# EAGLE board Wallaby2[1] (EAGLE 7.7.0), part 1 of 2
REV: B
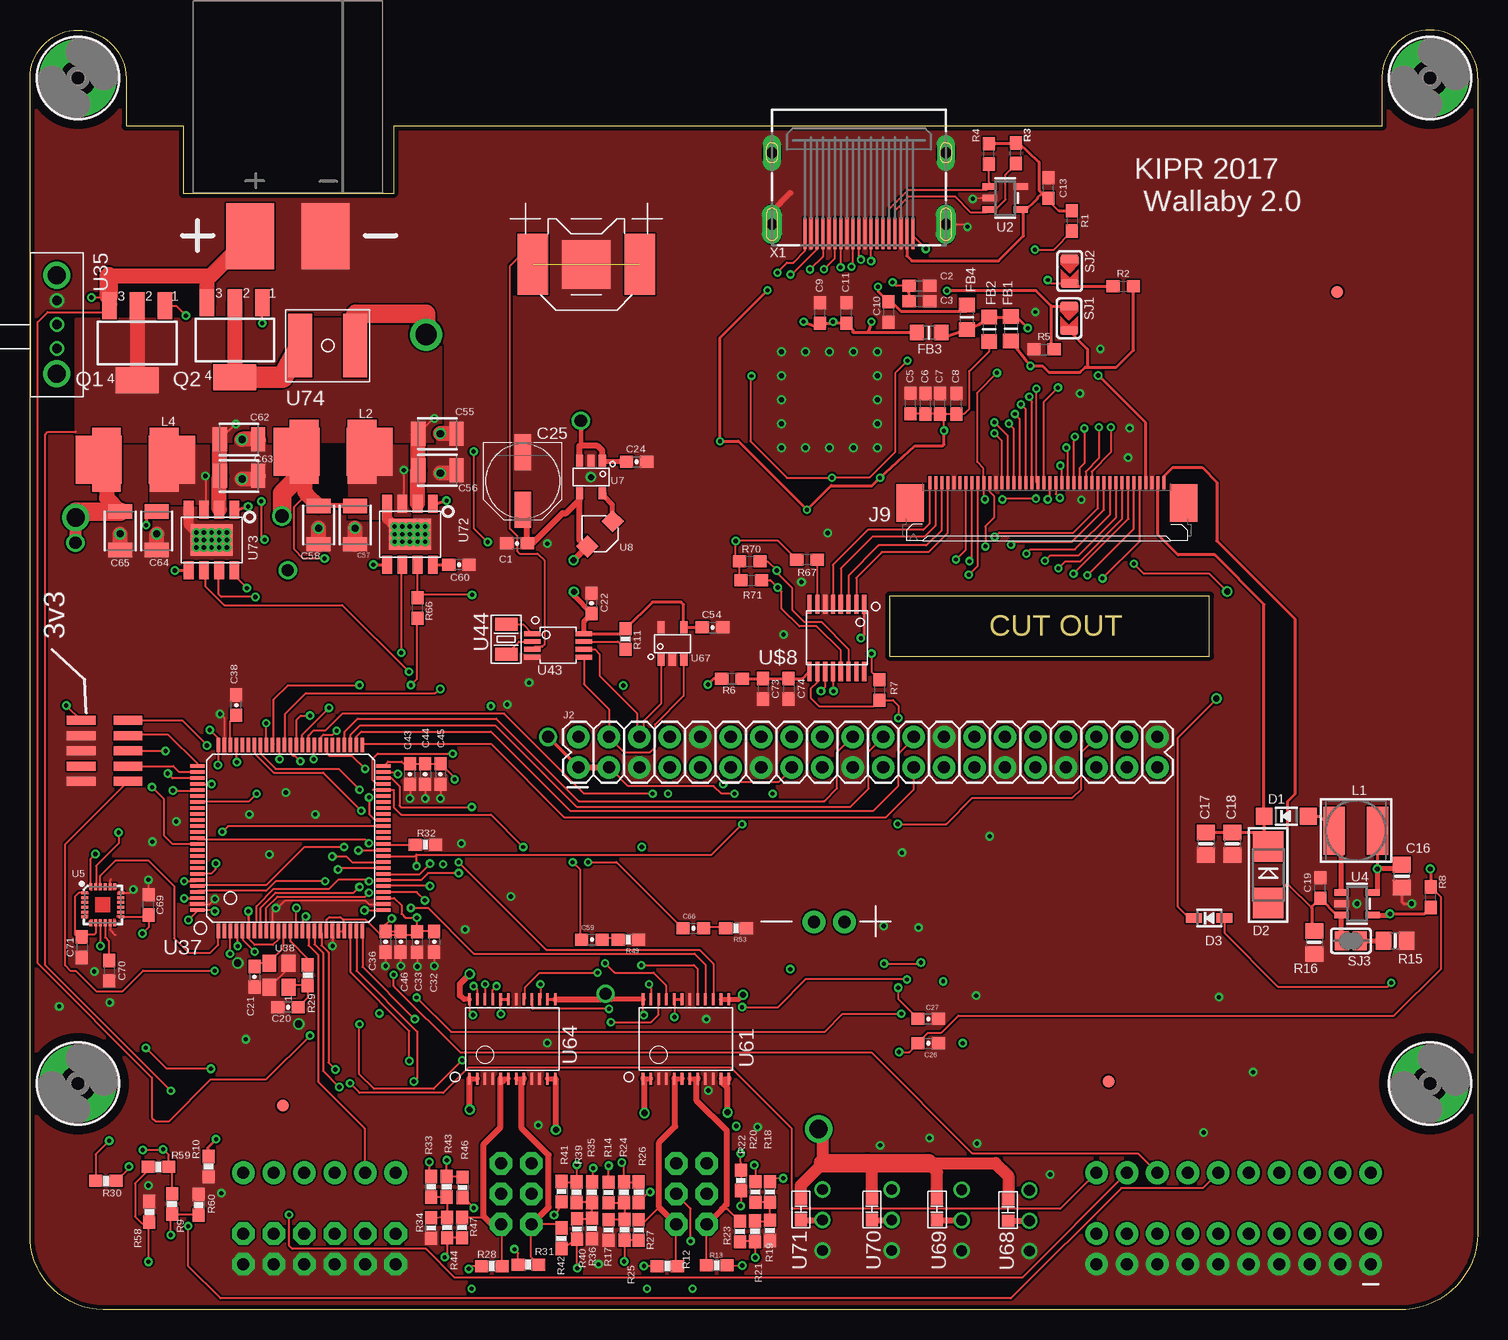
[diagram p17: board, top side]
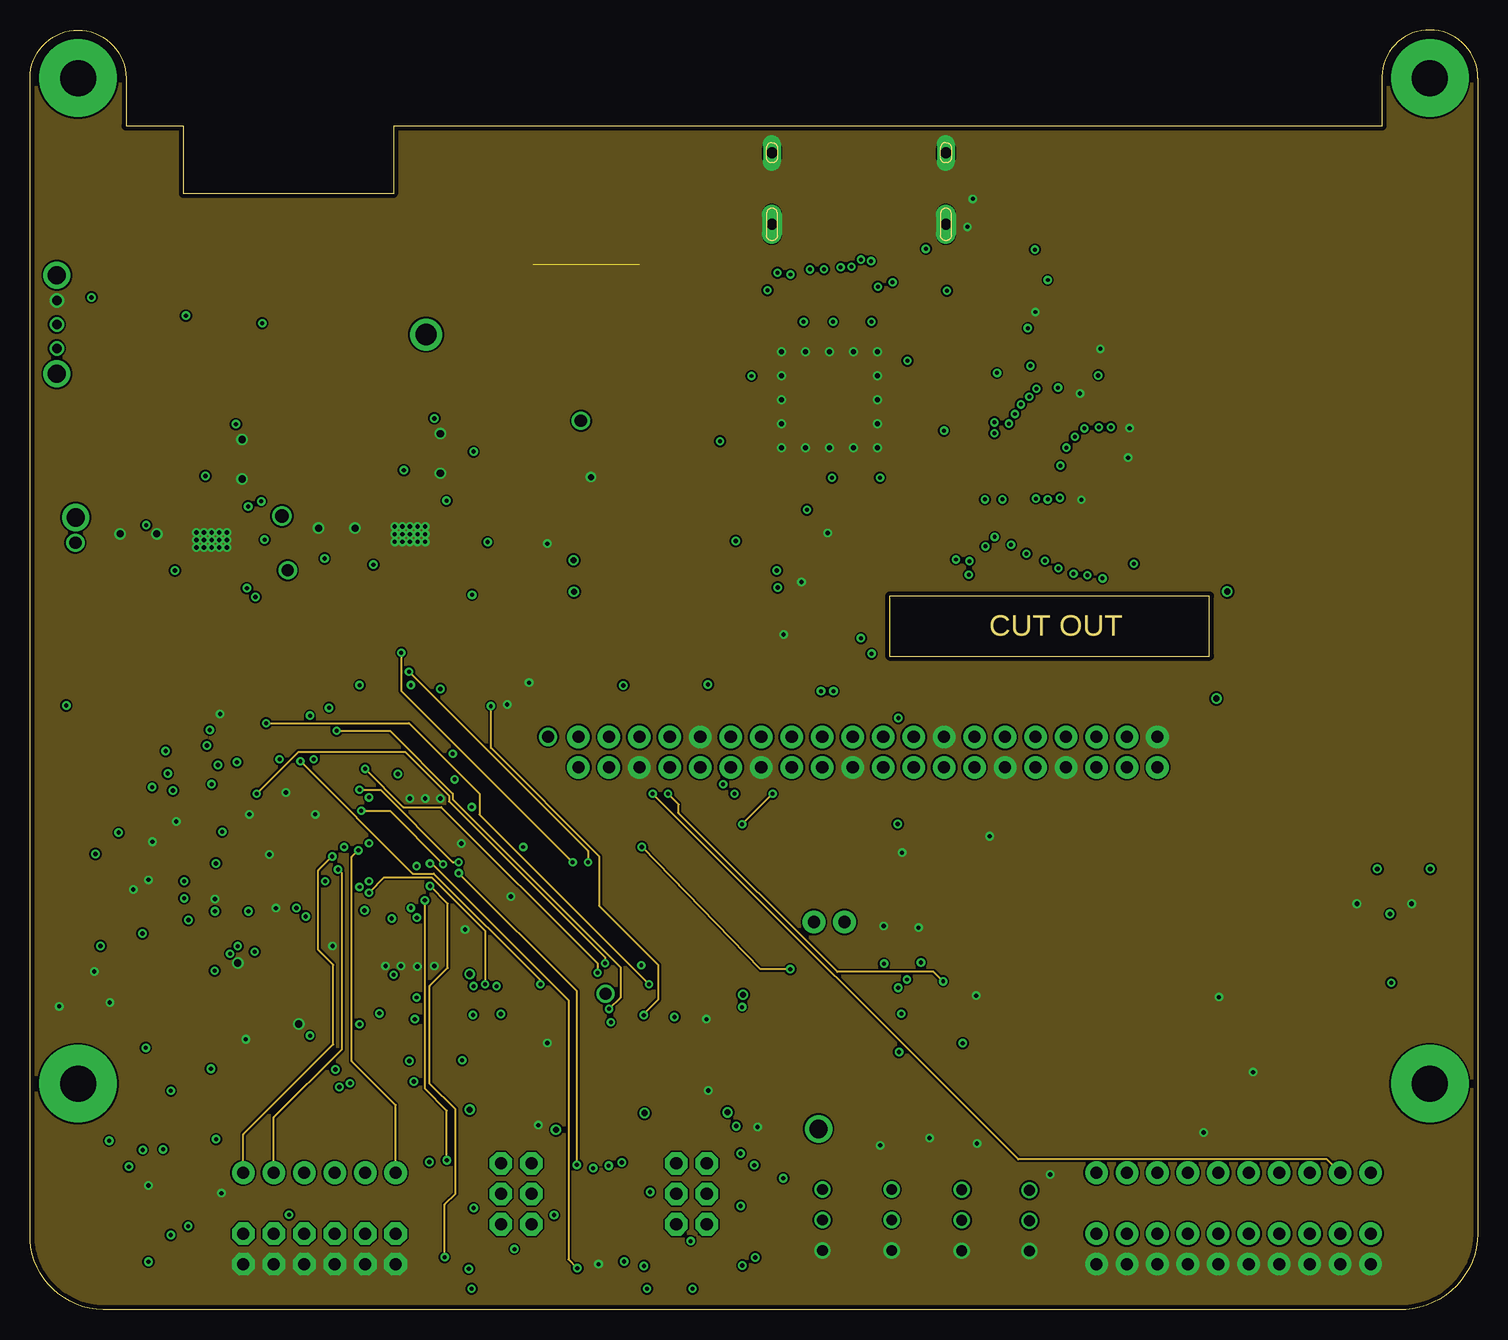
[diagram p18: board, inner layer GND2]
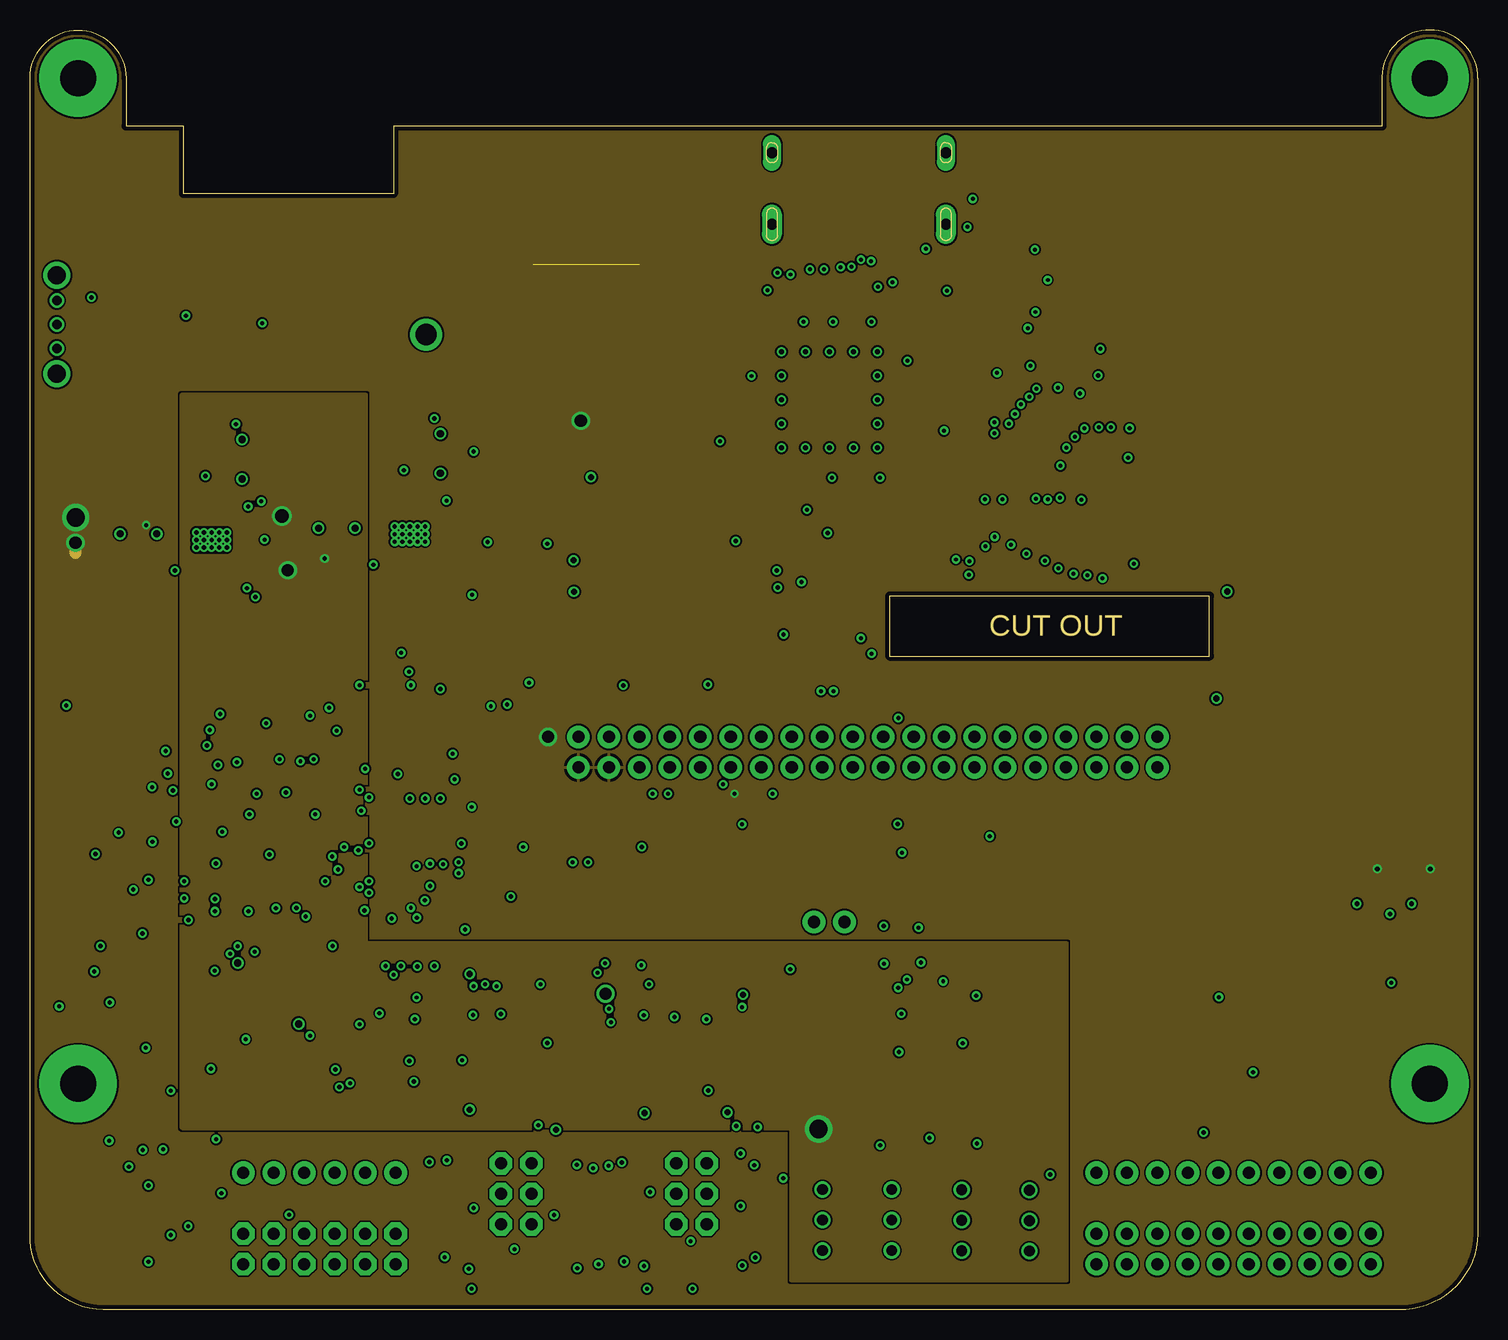
[diagram p19: board, inner layer 5V_6V]
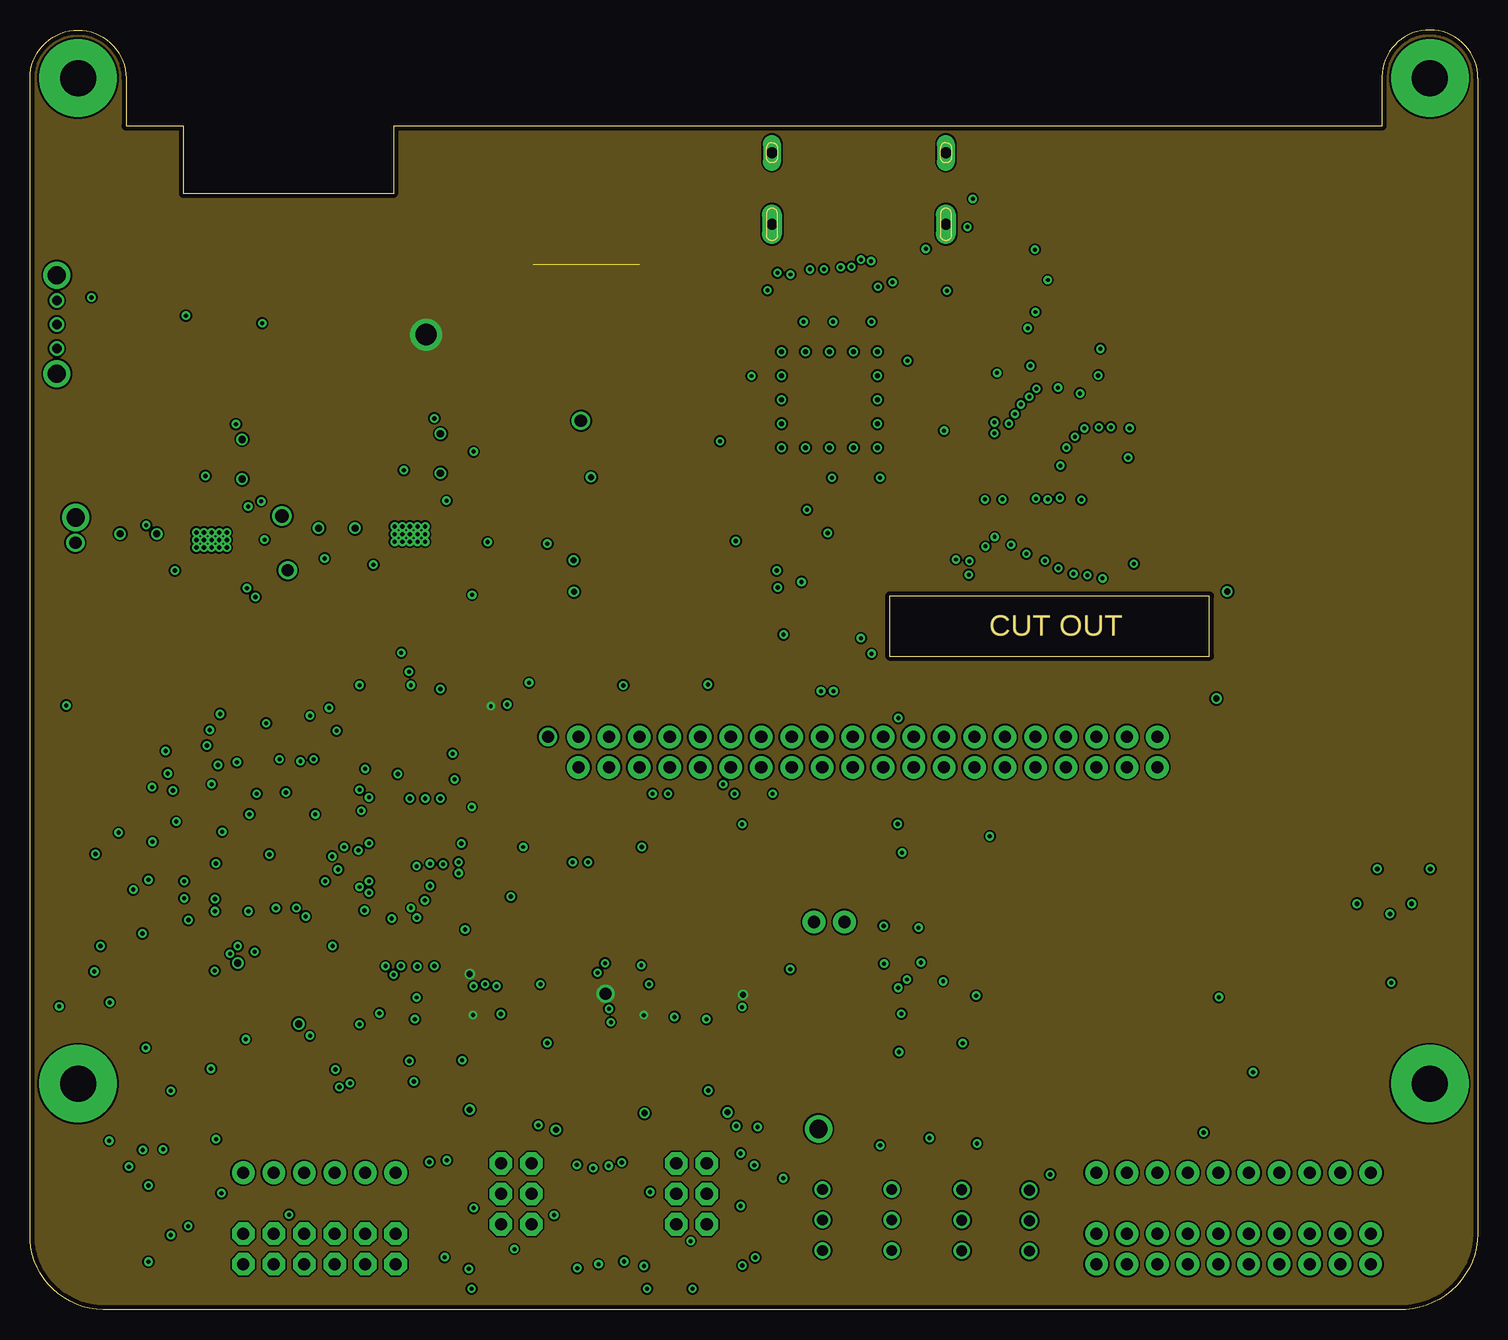
[diagram p20: board, inner layer VCC_BATT_FUSE]
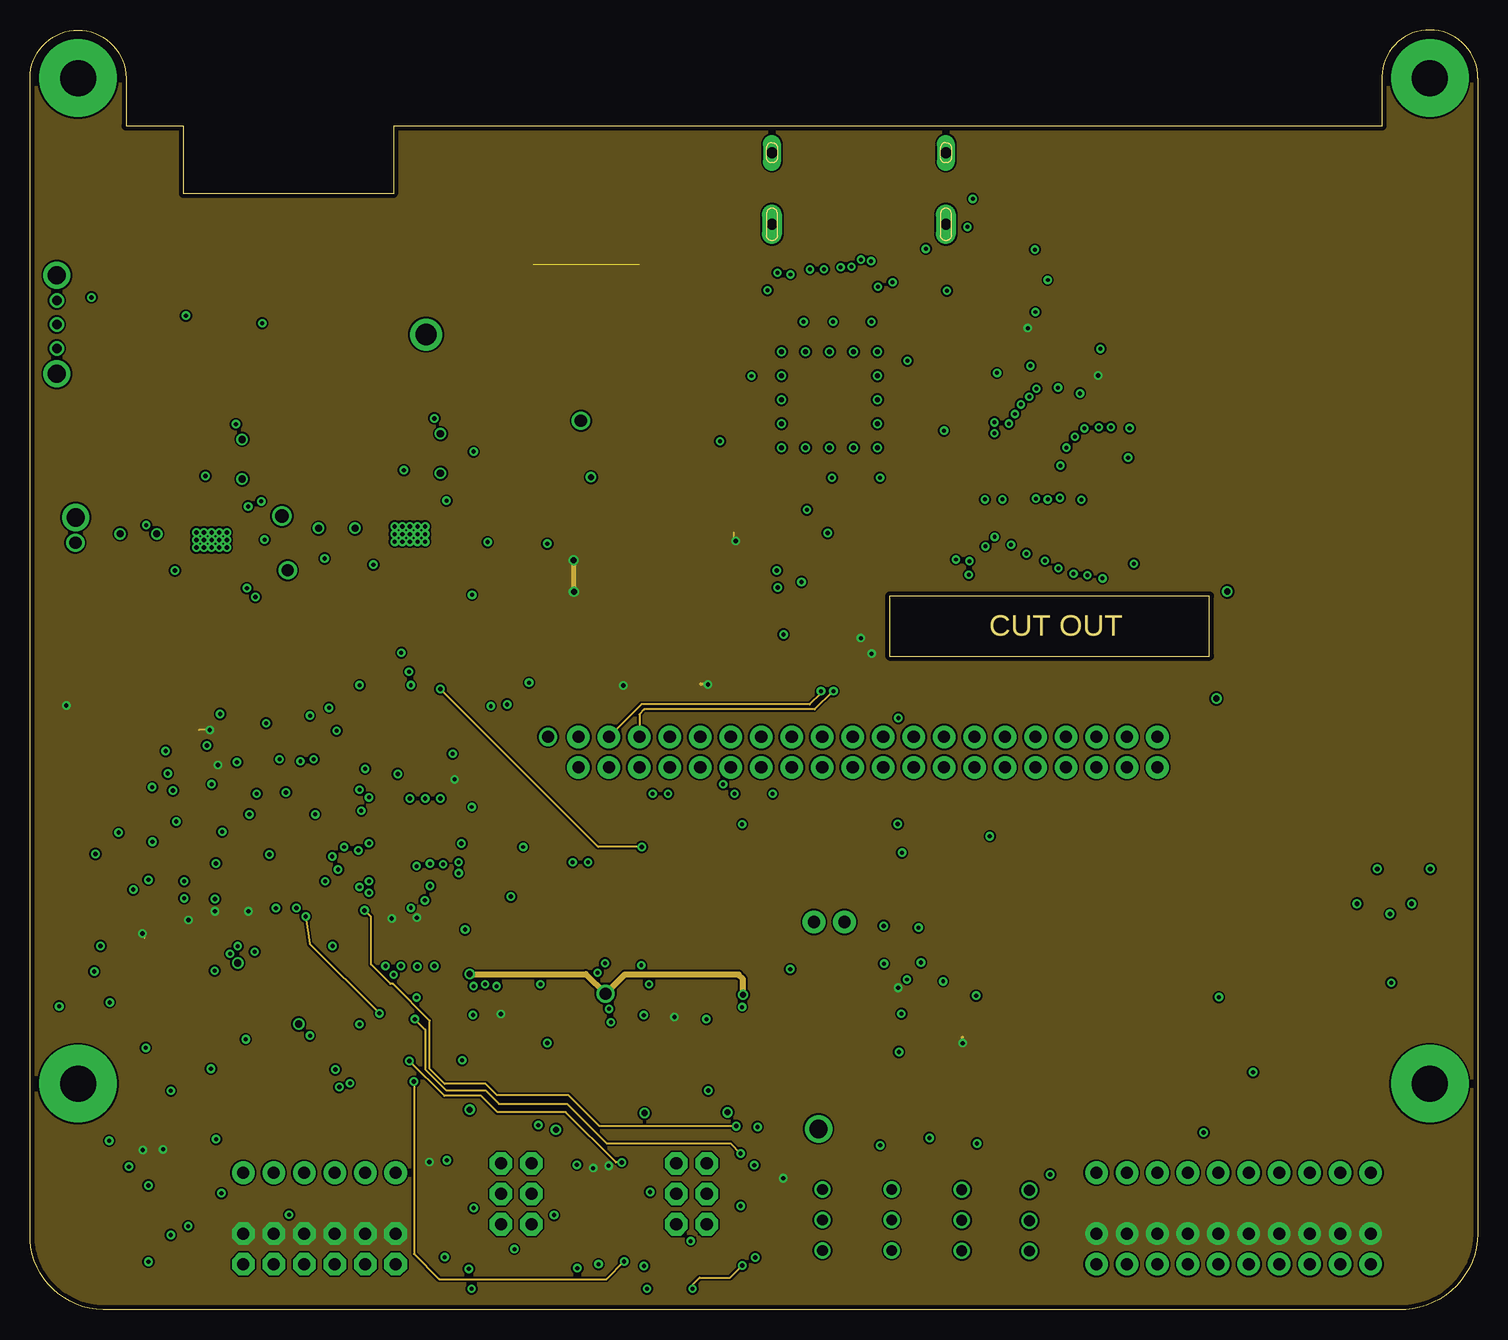
[diagram p21: board, inner layer 3V3]
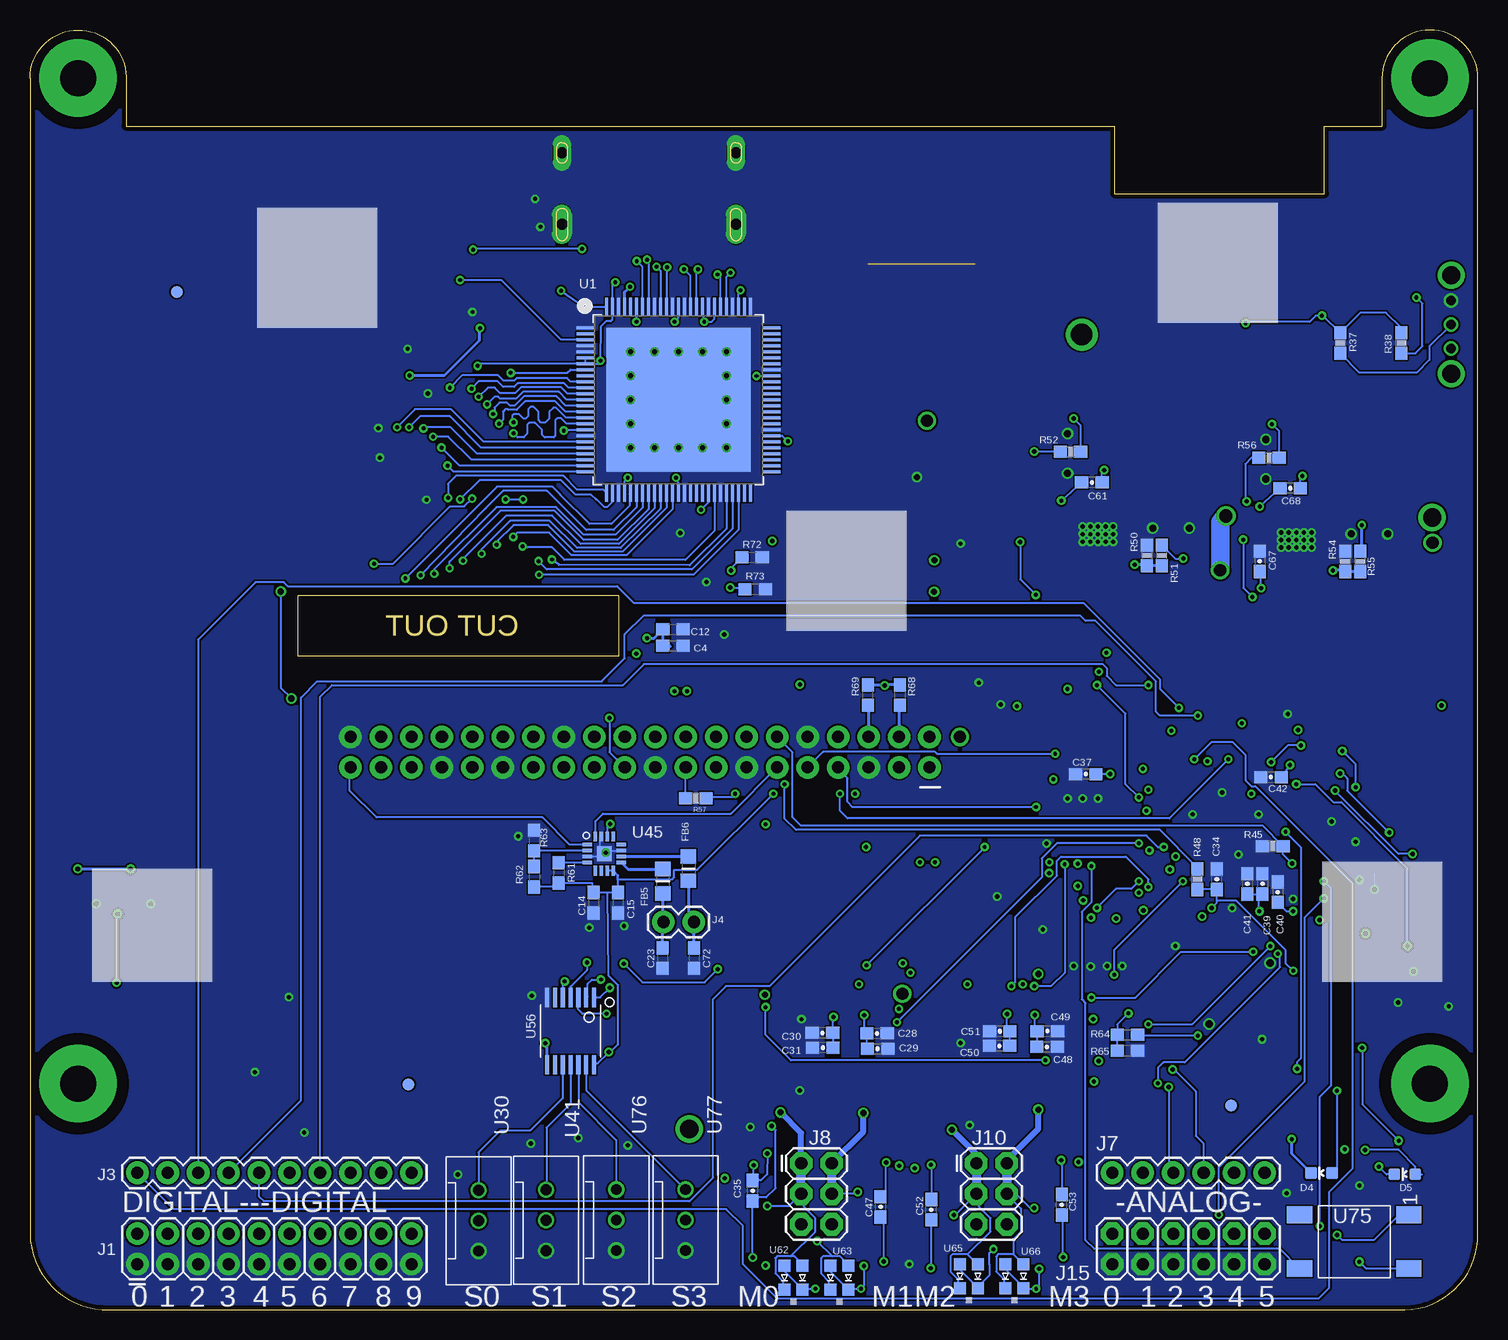
[diagram p22: board, bottom side, seen from below]

Size 120.7 x 106.66 mm. Coordinates in mm from the lower left corner, seen from the top.
Outline: 120.7,102.66 120.7,6.35 arc-90 114.1,0 6.1,0 arc-90 0,6.35 0,102.66 arc-90 4,106.66 arc-90 8,102.66 8,98.66 12.8,98.66 12.8,93.02 30.3,93.02 30.3,98.66 112.7,98.66 112.7,102.76 arc-90 116.7,106.66 arc-90 120.7,102.66
Outline: 71.66,59.51 98.33,59.51 98.33,54.49 71.66,54.49 71.66,59.51
Copper layers (1+2*3+14*15+16): PowerHF 0.0356mm / dielectric 1.5011mm / GND2 0.0356mm / dielectric 0.1499mm / 5V_6V 0.0356mm / dielectric 0.2007mm / VCC_BATT_FUSE 0.0356mm / dielectric 0.1499mm / 3V3 0.0356mm / dielectric 0.2007mm / GND16 0.0356mm
Design rules "LaenPCBOrder *": minimum track width 6mil, minimum drill 13mil, track to track 6mil, track to pad 6mil, pad to pad 6mil, via to via 6mil, smd to smd 6mil, copper to edge 15mil, drill to drill 6mil, minimum pad ring 7mil, minimum via ring 7mil, stop-mask expansion 3mil, vias tented up to drill 14mil, thermal gap 10mil

## Footprints (pad centres in the part's own frame; a part is rotated, then mirrored left to right if it is on the bottom)
0603-CAP = smd 1.1 x 1: 1 -0.85,0; 2 0.85,0
0603 = smd 1.1 x 1: 1 -0.85,0; 2 0.85,0
0805-NO = smd 1.3 x 1.5: 1 -0.95,0; 2 0.95,0
PANASONIC_D = smd 3 x 1.4: + 2.4,0; - -2.4,0
1210@1 = smd 1.2 x 2: 1 -1.6,0; 2 1.6,0
SOD-123 = smd 1.4 x 1.4: A 1.85,0; C -1.85,0
SMADIODE = smd 2.54 x 2.54: A 2.349,0; C -2.349,0
SOD-323 = smd 1.35 x 0.8: A 1.27,0; C -1.27,0
LED-0603 = smd 1 x 1: A 0,-0.877; C 0,0.877
_0805MP = smd 1.2 x 1.3: 1 -1.016,0; 2 1.016,0
FIDUCIAL-1X2.5 = smd 1 x 1: 1 0,0
2X10 = drill 1.016 pad 1.88: 1 0,0; 2 0,2.54; 3 2.54,0; 4 2.54,2.54; 5 5.08,0; 6 5.08,2.54; 7 7.62,0; 8 7.62,2.54; 9 10.16,0; 10 10.16,2.54; 11 12.7,0; 12 12.7,2.54; 13 15.24,0; 14 15.24,2.54; 15 17.78,0; 16 17.78,2.54; 17 20.32,0; 18 20.32,2.54; 19 22.86,0; 20 22.86,2.54
2X20 = drill 1.016 pad 1.88: 1 0,0; 2 0,2.54; 3 2.54,0; 4 2.54,2.54; 5 5.08,0; 6 5.08,2.54; 7 7.62,0; 8 7.62,2.54; 9 10.16,0; 10 10.16,2.54; 11 12.7,0; 12 12.7,2.54; 13 15.24,0; 14 15.24,2.54; 15 17.78,0; 16 17.78,2.54; 17 20.32,0; 18 20.32,2.54; 19 22.86,0; 20 22.86,2.54; 21 25.4,0; 22 25.4,2.54; 23 27.94,0; 24 27.94,2.54; 25 30.48,0; 26 30.48,2.54; 27 33.02,0; 28 33.02,2.54; 29 35.56,0; 30 35.56,2.54; 31 38.1,0; 32 38.1,2.54; 33 40.64,0; 34 40.64,2.54; 35 43.18,0; 36 43.18,2.54; 37 45.72,0; 38 45.72,2.54; 39 48.26,0; 40 48.26,2.54
1X10 = drill 1.016 pad 1.88: 1 0,0; 2 2.54,0; 3 5.08,0; 4 7.62,0; 5 10.16,0; 6 12.7,0; 7 15.24,0; 8 17.78,0; 9 20.32,0; 10 22.86,0
1X02 = drill 1.016 pad 1.88: 1 0,0; 2 2.54,0
1X06 = drill 1.016 pad 1.88: 1 0,0; 2 2.54,0; 3 5.08,0; 4 7.62,0; 5 10.16,0; 6 12.7,0
2X3 = drill 1.016 pad 1.88 octagon: 1 0,0; 2 0,2.54; 3 2.54,0; 4 2.54,2.54; 5 5.08,0; 6 5.08,2.54
4-1734839-0 = smd 0.25 x 1.1: 1 -9.75,-2.54; 2 -9.25,-2.54; 3 -8.75,-2.54; 4 -8.25,-2.54; 5 -7.75,-2.54; 6 -7.25,-2.54; 7 -6.75,-2.54; 8 -6.25,-2.54; 9 -5.75,-2.54; 10 -5.25,-2.54; 11 -4.75,-2.54; 12 -4.25,-2.54; 13 -3.75,-2.54; 14 -3.25,-2.54; 15 -2.75,-2.54; 16 -2.25,-2.54; 17 -1.75,-2.54; 18 -1.25,-2.54; 19 -0.75,-2.54; 20 -0.25,-2.54; 21 0.25,-2.54; 22 0.75,-2.54; 23 1.25,-2.54; 24 1.75,-2.54; 25 2.25,-2.54; 26 2.75,-2.54; 27 3.25,-2.54; 28 3.75,-2.54; 29 4.25,-2.54; 30 4.75,-2.54; 31 5.25,-2.54; 32 5.75,-2.54; 33 6.25,-2.54; 34 6.75,-2.54; 35 7.25,-2.54; 36 7.75,-2.54; 37 8.25,-2.54; 38 8.75,-2.54; 39 9.25,-2.54; 40 9.75,-2.54 | smd 2.3 x 3.1: M1 11.4,-0.84; M2 -11.4,-0.84
2X6 = drill 1.016 pad 1.88 octagon: 1 0,0; 2 0,2.54; 3 2.54,0; 4 2.54,2.54; 5 5.08,0; 6 5.08,2.54; 7 7.62,0; 8 7.62,2.54; 9 10.16,0; 10 10.16,2.54; 11 12.7,0; 12 12.7,2.54
INDUCTOR_5X5MM_NR5040_NOTHERMALS = smd 1.8 x 4: P$1 -1.8,0; P$2 1.8,0
INDUCT-3232-1050 = smd 3.85 x 4: P$1_1 -3.048,0; P$2_1 3.048,0 | smd 2.413 x 5.334: P$1_2 -2.413,0; P$2_2 2.413,0
SOT223 = smd 1.219 x 2.235: 1 -2.311,-3.099; 2 0,-3.099; 3 2.311,-3.099 | smd 3.6 x 2.2: 4 0,3.099
0603-RES = smd 1.1 x 1: 1 -0.85,0; 2 0.85,0
SOLDERJUMPER_ARROW_NOPASTE = smd 0.762 x 1.524: 1 -1.016,0; 2 1.016,0
SOLDERJUMPER_CLOSEDWIRE = smd 1.168 x 1.6: 1 -0.762,0; 2 0.762,0 | smd 0.635 x 0.203: WIRE 0,0
S-PQFP-G100 = smd 0.27 x 1.5: 1 -6,-7.75; 2 -5.5,-7.75; 3 -5,-7.75; 4 -4.5,-7.75; 5 -4,-7.75; 6 -3.5,-7.75; 7 -3,-7.75; 8 -2.5,-7.75; 9 -2,-7.75; 10 -1.5,-7.75; 11 -1,-7.75; 12 -0.5,-7.75; 13 0,-7.75; 14 0.5,-7.75; 15 1,-7.75; 16 1.5,-7.75; 17 2,-7.75; 18 2.5,-7.75; 19 3,-7.75; 20 3.5,-7.75; 21 4,-7.75; 22 4.5,-7.75; 23 5,-7.75; 24 5.5,-7.75; 25 6,-7.75; 51 6,7.75; 52 5.5,7.75; 53 5,7.75; 54 4.5,7.75; 55 4,7.75; 56 3.5,7.75; 57 3,7.75; 58 2.5,7.75; 59 2,7.75; 60 1.5,7.75; 61 1,7.75; 62 0.5,7.75; 63 0,7.75; 64 -0.5,7.75; 65 -1,7.75; 66 -1.5,7.75; 67 -2,7.75; 68 -2.5,7.75; 69 -3,7.75; 70 -3.5,7.75; 71 -4,7.75; 72 -4.5,7.75; 73 -5,7.75; 74 -5.5,7.75; 75 -6,7.75 | smd 1.5 x 0.27: 26 7.75,-6; 27 7.75,-5.5; 28 7.75,-5; 29 7.75,-4.5; 30 7.75,-4; 31 7.75,-3.5; 32 7.75,-3; 33 7.75,-2.5; 34 7.75,-2; 35 7.75,-1.5; 36 7.75,-1; 37 7.75,-0.5; 38 7.75,0; 39 7.75,0.5; 40 7.75,1; 41 7.75,1.5; 42 7.75,2; 43 7.75,2.5; 44 7.75,3; 45 7.75,3.5; 46 7.75,4; 47 7.75,4.5; 48 7.75,5; 49 7.75,5.5; 50 7.75,6; 76 -7.75,6; 77 -7.75,5.5; 78 -7.75,5; 79 -7.75,4.5; 80 -7.75,4; 81 -7.75,3.5; 82 -7.75,3; 83 -7.75,2.5; 84 -7.75,2; 85 -7.75,1.5; 86 -7.75,1; 87 -7.75,0.5; 88 -7.75,0; 89 -7.75,-0.5; 90 -7.75,-1; 91 -7.75,-1.5; 92 -7.75,-2; 93 -7.75,-2.5; 94 -7.75,-3; 95 -7.75,-3.5; 96 -7.75,-4; 97 -7.75,-4.5; 98 -7.75,-5; 99 -7.75,-5.5; 100 -7.75,-6 | drill 0.4: P$1 -4,4; P$2 -2,4; P$3 0,4; P$4 2,4; P$5 4,4; P$6 4,2; P$7 4,0; P$8 4,-2; P$9 4,-4; P$10 2,-4; P$11 0,-4; P$12 -2,-4; P$13 -4,-4; P$14 -4,-2; P$15 -4,0; P$16 -4,2 | smd 12 x 12: THERMAL 0,0
SOT23-5 = smd 0.55 x 1.2: 1 -0.95,-1.3; 2 0,-1.3; 3 0.95,-1.3; 4 0.95,1.3; 5 -0.95,1.3
XT60-FP-MH = smd 5.5 x 4: NEG 3.6,3.15; POS 3.6,-3.15
QFN24-3X3 = smd 0.495 x 0.25: 1 -1.552,1; 6 -1.552,-1; 13 1.552,-1; 18 1.552,1 | smd 0.6 x 0.25: 2 -1.5,0.6; 3 -1.5,0.2; 4 -1.5,-0.2; 5 -1.5,-0.6; 14 1.5,-0.6; 15 1.5,-0.2; 16 1.5,0.2; 17 1.5,0.6 | smd 0.25 x 0.495: 7 -1,-1.552; 12 1,-1.552; 19 1,1.552; 24 -1,1.552 | smd 0.25 x 0.6: 8 -0.6,-1.5; 9 -0.2,-1.5; 10 0.2,-1.5; 11 0.6,-1.5; 20 0.6,1.5; 21 0.2,1.5; 22 -0.2,1.5; 23 -0.6,1.5
SOT-23-5 = smd 0.6 x 1: P$1 -0.95,-1.35; P$2 0,-1.35; P$3 0.95,-1.35; P$4 0.95,1.35; P$5 -0.95,1.35
3P2MM-X-3P2MM-INDUCTOR = smd 1.3 x 1.3 rotated 315: P$1 -1.061,1.061; P$2 1.061,-1.061
HEADER-5-103414-1 = drill 0.9: P$1 -2.54,0; P$2 0,0; P$3 2.54,0
MOUNTINGHOLE_3.0_PLATED = drill 3 pad 6.452: P$1 0,0
OS-SPDT-MINI-SLIDE_SWITCH = drill 1.5: NC_1 -4.1,0; NC_2 4.1,0 | drill 0.8: P$1 -2,0; P$2 0,0; P$3 2,0
LQFP-100 = smd 0.3 x 1.2: P$1 -6,-7.75; P$2 -5.5,-7.75; P$3 -5,-7.75; P$4 -4.5,-7.75; P$5 -4,-7.75; P$6 -3.5,-7.75; P$7 -3,-7.75; P$8 -2.5,-7.75; P$9 -2,-7.75; P$10 -1.5,-7.75; P$11 -1,-7.75; P$12 -0.5,-7.75; P$13 0,-7.75; P$14 0.5,-7.75; P$15 1,-7.75; P$16 1.5,-7.75; P$17 2,-7.75; P$18 2.5,-7.75; P$19 3,-7.75; P$20 3.5,-7.75; P$21 4,-7.75; P$22 4.5,-7.75; P$23 5,-7.75; P$24 5.5,-7.75; P$25 6,-7.75; P$51 6,7.75; P$52 5.5,7.75; P$53 5,7.75; P$54 4.5,7.75; P$55 4,7.75; P$56 3.5,7.75; P$57 3,7.75; P$58 2.5,7.75; P$59 2,7.75; P$60 1.5,7.75; P$61 1,7.75; P$62 0.5,7.75; P$63 0,7.75; P$64 -0.5,7.75; P$65 -1,7.75; P$66 -1.5,7.75; P$67 -2,7.75; P$68 -2.5,7.75; P$69 -3,7.75; P$70 -3.5,7.75; P$71 -4,7.75; P$72 -4.5,7.75; P$73 -5,7.75; P$74 -5.5,7.75; P$75 -6,7.75 | smd 1.2 x 0.3: P$26 7.75,-6; P$27 7.75,-5.5; P$28 7.75,-5; P$29 7.75,-4.5; P$30 7.75,-4; P$31 7.75,-3.5; P$32 7.75,-3; P$33 7.75,-2.5; P$34 7.75,-2; P$35 7.75,-1.5; P$36 7.75,-1; P$37 7.75,-0.5; P$38 7.75,0; P$39 7.75,0.5; P$40 7.75,1; P$41 7.75,1.5; P$42 7.75,2; P$43 7.75,2.5; P$44 7.75,3; P$45 7.75,3.5; P$46 7.75,4; P$47 7.75,4.5; P$48 7.75,5; P$49 7.75,5.5; P$50 7.75,6; P$76 -7.75,6; P$77 -7.75,5.5; P$78 -7.75,5; P$79 -7.75,4.5; P$80 -7.75,4; P$81 -7.75,3.5; P$82 -7.75,3; P$83 -7.75,2.5; P$84 -7.75,2; P$85 -7.75,1.5; P$86 -7.75,1; P$87 -7.75,0.5; P$88 -7.75,0; P$89 -7.75,-0.5; P$90 -7.75,-1; P$91 -7.75,-1.5; P$92 -7.75,-2; P$93 -7.75,-2.5; P$94 -7.75,-3; P$95 -7.75,-3.5; P$96 -7.75,-4; P$97 -7.75,-4.5; P$98 -7.75,-5; P$99 -7.75,-5.5; P$100 -7.75,-6
TSX-3225 = smd 1.4 x 1.15: P$1 -1,-0.8; P$2 1,-0.8; P$3 1,0.8; P$4 -1,0.8
CORTEX-JTAG-HDR = smd 2.4 x 0.74: P$1 -1.95,2.54; P$2 1.95,2.54; P$3 -1.95,1.27; P$4 1.95,1.27; P$5 -1.95,0; P$6 1.95,0; P$7 -1.95,-1.27; P$8 1.95,-1.27; P$9 -1.95,-2.54; P$10 1.95,-2.54
COIN_CELL_HOLDER_6P8MM = smd 4.064 x 4.064: P_MIN 0,0 | smd 2.54 x 5.08: P_PLUS_1 -4.445,0; P_PLUS_2 4.445,0
USOP-8 = smd 1.35 x 0.4: P$1 -2.15,0.975; P$2 -2.15,0.325; P$3 -2.15,-0.325; P$4 -2.15,-0.975; P$5 2.15,-0.975; P$6 2.15,-0.325; P$7 2.15,0.325; P$8 2.15,0.975
CRYSTAL-ECX34B-3P2MM_1P5MM = smd 1.1 x 1.9: P$1 -1.25,0; P$2 1.25,0
TQFN-16 = smd 1.23 x 1.23: GND 0,0 | smd 0.3 x 0.8: P$1 -0.75,-1.425; P$2 -0.25,-1.425; P$3 0.25,-1.425; P$4 0.75,-1.425; P$9 0.75,1.425; P$10 0.25,1.425; P$11 -0.25,1.425; P$12 -0.75,1.425 | smd 0.8 x 0.3: P$5 1.425,-0.75; P$6 1.425,-0.25; P$7 1.425,0.25; P$8 1.425,0.75; P$13 -1.425,0.75; P$14 -1.425,0.25; P$15 -1.425,-0.25; P$16 -1.425,-0.75
TSSOP14 = smd 0.35 x 1.6: P$1 -1.95,-2.8; P$2 -1.3,-2.8; P$3 -0.65,-2.8; P$4 0,-2.8; P$5 0.65,-2.8; P$6 1.3,-2.8; P$7 1.95,-2.8; P$8 1.95,2.8; P$9 1.3,2.8; P$10 0.65,2.8; P$11 0,2.8; P$12 -0.65,2.8; P$13 -1.3,2.8; P$14 -1.95,2.8
SSOP24 = smd 0.22 x 1: P$1 -3.25,-3.3; P$2 -2.6,-3.3; P$3 -1.95,-3.3; P$4 -1.3,-3.3; P$5 -0.65,-3.3; P$6 0,-3.3; P$7 0.65,-3.3; P$8 1.3,-3.3; P$9 1.95,-3.3; P$10 2.6,-3.3; P$11 3.25,-3.3; P$12 3.9,-3.3; P$13 3.9,3.3; P$14 3.25,3.3; P$15 2.6,3.3; P$16 1.95,3.3; P$17 1.3,3.3; P$18 0.65,3.3; P$19 0,3.3; P$20 -0.65,3.3; P$21 -1.3,3.3; P$22 -1.95,3.3; P$23 -2.6,3.3; P$24 -3.25,3.3
DUAL_SMT_LED = smd 1 x 1: P$1 1,0.75; P$2 -1,0.75; P$3 1,-0.75; P$4 -1,-0.75
0603' = smd 1.016 x 1.016: P$1 -0.889,0; P$2 0.889,0
SO-8EP = smd 0.802 x 1.5: 1 -1.905,-2.54; 2 -0.635,-2.54; 3 0.635,-2.54; 4 1.905,-2.54; 5 1.905,2.54; 6 0.635,2.54; 7 -0.635,2.54; 8 -1.905,2.54 | smd 3.502 x 2.613: GND 0,0 | drill 0.356 pad 0.406: V$1 -1.27,0.635; V$2 -0.635,0.635; V$3 0,0.635; V$4 0.635,0.635; V$5 1.27,0.635; V$6 -1.27,0; V$7 -0.635,0; V$8 0,0; V$9 0.635,0; V$10 1.27,0; V$11 -1.27,-0.635; V$12 -0.635,-0.635; V$13 0,-0.635; V$14 0.635,-0.635; V$15 1.27,-0.635
FUSE-2920 = smd 2 x 5.3: P$1 -2.3,0; P$2 2.3,0
BUTTON-1571527-2 = smd 1.4 x 2.1: P$1 -2.24,4.55; P$2 -2.24,-4.55; P$3 2.24,4.55; P$4 2.24,-4.55
TSSOP16 = smd 0.35 x 1.6: P$1 -2.275,-2.8; P$2 -1.625,-2.8; P$3 -0.975,-2.8; P$4 -0.325,-2.8; P$5 0.325,-2.8; P$6 0.975,-2.8; P$7 1.625,-2.8; P$8 2.275,-2.8; P$9 2.275,2.8; P$10 1.625,2.8; P$11 0.975,2.8; P$12 0.325,2.8; P$13 -0.325,2.8; P$14 -0.975,2.8; P$15 -1.625,2.8; P$16 -2.275,2.8
HDMI_MOLEX_47151-0001_DIMLAYER = smd 0.25 x 2.6: 1 4.5,0; 2 4,0; 3 3.5,0; 4 3,0; 5 2.5,0; 6 2,0; 7 1.5,0; 8 1,0; 9 0.5,0; 10 0,0; 11 -0.5,0; 12 -1,0; 13 -1.5,0; 14 -2,0; 15 -2.5,0; 16 -3,0; 17 -3.5,0; 18 -4,0; 19 -4.5,0 | drill 0.9 pad 1.65 long: P$1 -7.25,-0.76; P$2 7.25,-0.76 | drill 0.9 pad 1.5 long: P$3 7.25,-6.72; P$4 -7.25,-6.72

## Placement (x,y rotation side)
C1  10uF  [0603-CAP]  40.6,63.88 180 top
C2  0.1uF  [0603]  74.14,85.34 0 top
C3  0.1uF  [0603]  74.14,84.07 0 top
C4  0.1uF  [0603]  67.11,55.35 0 bottom
C5  0.1uF  [0603]  73.41,75.54 90 top
C6  0.1uF  [0603]  74.65,75.51 90 top
C7  0.1uF  [0603]  75.84,75.51 90 top
C8  0.1uF  [0603]  77.22,75.51 90 top
C9  0.1uF  [0603]  65.86,83.08 90 top
C10  0.1uF  [0603]  71.55,83.16 270 top
C11  0.1uF  [0603]  68.05,83.08 90 top
C12  2.2uF  [0603]  67.11,56.72 0 bottom
C13  0.1uF  [0603]  84.91,93.5 90 top
C14  10uF  [0603]  73.74,33.93 270 bottom
C15  0.1uF  [0603]  71.68,33.93 270 bottom
C16  10uF  [0805-NO]  114.37,36.15 90 top
C17  1uF  [0805-NO]  98.02,38.85 270 top
C18  1uF  [0805-NO]  100.22,38.85 270 top
C19  0.1uF  [0603]  107.54,35.15 90 top
C20  22pf  [0603-CAP]  21.51,25.22 180 top
C21  22pf  [0603-CAP]  18.72,27.76 270 top
C22  0.1uF  [0603-CAP]  46.81,58.88 270 top
C23  22pF  [0603]  67.97,29.31 270 bottom
C24  4.7uF  [0603-CAP]  50.57,70.67 0 top
C25  330uF  [PANASONIC_D]  41.08,69.07 270 top
C26  0.1uF  [0603-CAP]  74.88,22.22 0 top
C27  0.1uF  [0603-CAP]  74.88,24.26 0 top
C28  0.1uF 20V  [0603-CAP]  50.09,23.04 0 bottom
C29  10uF 20V  [0603-CAP]  50.04,21.77 0 bottom
C30  10uF 20V  [0603-CAP]  54.64,23.09 180 bottom
C31  0.1uF 20V  [0603-CAP]  54.61,21.84 180 bottom
C32  0.1uF  [0603-CAP]  33.71,30.68 270 top
C33  1uF  [0603-CAP]  32.26,30.66 270 top
C34  0.1uF  [0603-CAP]  21.77,35.89 90 bottom
C35  22pf  [0603-CAP]  60.45,9.93 90 bottom
C36  1uF  [0603-CAP]  29.64,30.68 270 top
C37  2.2uF  [0603-CAP]  32.69,44.65 180 bottom
C38  2.2uF  [0603-CAP]  17.2,50.39 90 top
C39  4.7uF  [0603-CAP]  17.96,35.51 270 bottom
C40  0.1uF  [0603-CAP]  16.69,34.81 270 bottom
C41  0.1uF  [0603-CAP]  19.23,35.51 270 bottom
C42  0.1uF  [0603-CAP]  17.25,44.4 0 bottom
C43  0.1uF  [0603-CAP]  31.67,44.65 90 top
C44  0.1uF  [0603-CAP]  32.94,44.65 270 top
C45  0.1uF  [0603-CAP]  34.21,44.65 270 top
C46  0.1uF  [0603-CAP]  30.91,30.68 270 top
C47  22pf  [0603-CAP]  49.78,8.59 90 bottom
C48  0.1uF 20V  [0603-CAP]  35.92,21.92 0 bottom
C49  10uF 20V  [0603-CAP]  35.89,23.24 0 bottom
C50  10uF 20V  [0603-CAP]  39.88,22 180 bottom
C51  0.1uF 20V  [0603-CAP]  39.85,23.22 180 bottom
C52  22pf  [0603-CAP]  45.57,8.36 90 bottom
C53  22pf  [0603-CAP]  34.7,8.76 90 bottom
C54  0.1uF 20V  [0603-CAP]  56.9,56.87 0 top
C55  22uF  [1210@1]  33.96,73.03 0 top
C56  22uF  [1210@1]  33.96,69.98 0 top
C57  22uF  [1210@1]  27.1,65.41 270 top
C58  47uF  [1210@1]  24.05,65.41 270 top
C59  6p8nF  [0603-CAP]  46.84,30.86 0 top
C60  0p1uF  [0603-CAP]  35.76,62.1 180 top
C61  10nF  [0603-CAP]  32.18,68.96 180 bottom
C62  22uF  [1210@1]  17.42,72.54 0 top
C63  22uF  [1210@1]  17.42,69.49 0 top
C64  22uF  [1210@1]  10.57,64.92 270 top
C65  47uF  [1210@1]  7.52,64.92 270 top
C66  6p8nF  [0603-CAP]  55.3,31.8 0 top
C67  0p1uF  [0603-CAP]  18.19,62.38 270 bottom
C68  10nF  [0603-CAP]  15.65,68.48 180 bottom
C69  0.1uF  [0603]  9.88,33.76 90 top
C70  0.1uF  [0603]  6.6,28.27 270 top
C71  10pF  [0603]  4.32,30.23 270 top
C72  22pF  [0603]  65.35,29.31 270 bottom
C73  2.2uF  [0603]  61.09,51.77 270 top
C74  0.1uF  [0603]  63.25,51.77 270 top
D1  MBR0540  [SOD-123]  104.72,41.15 0 top
D2  MM3Z24VT1G  [SMADIODE]  103.22,36.25 270 top
D3  1N4148  [SOD-323]  98.3,32.66 0 top
D4  red  [LED-0603]  13.03,11.4 90 bottom
D5  yellow  [LED-0603]  6.1,11.3 90 bottom
FB1  Ferrite  [_0805MP]  81.77,81.76 270 top
FB2  Ferrite  [_0805MP]  79.96,81.73 270 top
FB3  Ferrite  [_0805MP]  74.96,81.44 180 top
FB4  Ferrite  [_0805MP]  78.1,82.73 90 top
FB5  Ferrite  [_0805MP]  67.94,35.71 270 bottom
FB6  Ferrite  [_0805MP]  65.81,36.78 270 bottom
FID1  FIDUCIAL1X2.5  [FIDUCIAL-1X2.5]  89.92,19.05 0 top
FID2  FIDUCIAL1X2.5  [FIDUCIAL-1X2.5]  108.97,84.84 0 top
FID3  FIDUCIAL1X2.5  [FIDUCIAL-1X2.5]  21.08,17.02 0 top
FID4  FIDUCIAL1X2.5  [FIDUCIAL-1X2.5]  108.46,84.84 0 bottom
FID5  FIDUCIAL1X2.5  [FIDUCIAL-1X2.5]  89.15,18.8 0 bottom
FID6  FIDUCIAL1X2.5  [FIDUCIAL-1X2.5]  20.57,17.02 0 bottom
J1  [2X10]  111.76,3.81 0 bottom
J2  CONN_20X2  [2X20]  45.72,45.21 0 top
J3  [1X10]  111.76,11.43 0 bottom
J4  [1X02]  67.89,32.33 0 bottom
J7  [1X06]  30.48,11.43 0 bottom
J8  FEMALE 2x3  [2X3]  56.41,12.22 270 bottom
J9  40PINFPCM4-1734839-0  [4-1734839-0]  84.76,66.4 180 top
J10  FEMALE 2x3  [2X3]  41.81,12.22 270 bottom
J15  2X6 FEMALE  [2X6]  30.48,3.81 0 bottom
L1  15uH  [INDUCTOR_5X5MM_NR5040_NOTHERMALS]  110.52,39.95 180 top
L2  6.5uH  [INDUCT-3232-1050]  25.27,71.53 180 top
L4  6.5uH  [INDUCT-3232-1050]  8.79,70.87 180 top
Q1  BSP170P  [SOT223]  8.94,80.57 180 top
Q2  BSP170P  [SOT223]  17.07,80.82 180 top
R1  10k  [0603]  86.87,90.75 270 top
R2  10k  [0603]  91.14,85.29 0 top
R3  10k  [0603]  82.17,96.39 90 top
R4  10k  [0603]  79.93,96.34 90 top
R5  10k  [0603]  84.53,80.04 0 top
R6  0  [0603]  58.52,52.6 0 top
R7  47k  [0603]  70.82,51.66 270 top
R8  10k  [0603]  116.79,34.39 90 top
R9  1K  [0603-RES]  11.84,8.84 90 top
R10  1K  [0603-RES]  14.91,11.94 90 top
R11  10K  [0603-RES]  49.66,55.91 90 top
R12  1K  [0603-RES]  53.11,3.66 180 top
R13  1K  [0603-RES]  57.25,3.71 180 top
R14  470R  [0603-RES]  48.23,9.78 90 top
R15  12  [0805-NO]  113.79,30.75 0 top
R16  12  [0805-NO]  107.07,30.62 270 top
R17  470R  [0603-RES]  48.23,6.65 90 top
R18  470R  [0603-RES]  61.7,9.83 90 top
R19  470R  [0603-RES]  61.7,6.63 90 top
R20  2k2  [0603-RES]  60.48,9.83 90 top
R21  2k2  [0603-RES]  60.43,6.55 270 top
R22  6k8  [0603-RES]  59.28,10.79 270 top
R23  6k8  [0603-RES]  59.18,6.53 90 top
R24  2k2  [0603-RES]  49.53,9.8 90 top
R25  2k2  [0603-RES]  49.56,6.68 270 top
R26  6k8  [0603-RES]  50.75,9.8 270 top
R27  6k8  [0603-RES]  50.75,6.65 90 top
R28  1K  [0603-RES]  38.51,3.66 180 top
R29  240R  [0603-RES]  23.16,27.89 270 top
R30  1K  [0603-RES]  6.32,10.74 0 top
R31  1K  [0603-RES]  41.55,3.78 0 top
R32  10K  [0603-RES]  32.97,38.76 180 top
R33  470R  [0603-RES]  33.43,10.26 90 top
R34  470R  [0603-RES]  33.43,6.83 90 top
R35  470R  [0603-RES]  46.84,9.8 90 top
R36  470R  [0603-RES]  46.84,6.78 90 top
R37  3K3  [0603-RES]  11.48,80.57 270 bottom
R38  100K  [0603-RES]  6.4,80.57 90 bottom
R39  2k2  [0603-RES]  45.57,9.8 90 top
R40  2k2  [0603-RES]  45.62,6.76 270 top
R41  6k8  [0603-RES]  44.32,9.86 270 top
R42  6k8  [0603-RES]  44.3,5.97 90 top
R43  2k2  [0603-RES]  34.75,10.26 90 top
R44  2k2  [0603-RES]  34.77,6.86 270 top
R45  10K  [0603-RES]  17.09,38.66 0 bottom
R46  6k8  [0603-RES]  36.07,10.21 270 top
R47  6k8  [0603-RES]  36.02,6.86 90 top
R48  0R  [0603-RES]  23.39,35.89 90 bottom
R49  10k5 1%  [0603-RES]  49.89,30.86 180 top
R50  10k 1%  [0603-RES]  27.61,62.87 270 bottom
R51  64k9 1%  [0603-RES]  26.34,62.87 90 bottom
R52  100k 1%  [0603-RES]  33.96,71.5 0 bottom
R53  10k5 1%  [0603-RES]  58.85,31.8 180 top
R54  10k 1%  [0603-RES]  11.07,62.38 270 bottom
R55  52k3 1%  [0603-RES]  9.8,62.38 90 bottom
R56  100k 1%  [0603-RES]  17.42,71.02 0 bottom
R57  1K  [0603-RES]  65.2,42.62 180 bottom
R58  10K  [0603-RES]  9.96,8.18 270 top
R59  DNP  [0603-RES]  10.72,11.91 180 top
R60  DNP  [0603-RES]  14.07,8.76 270 top
R61  1M  [0603]  76.63,36.42 270 bottom
R62  DNP  [0603]  78.66,36.09 270 bottom
R63  DNP  [0603]  78.66,39.12 270 bottom
R64  100k  [0603]  29.21,22.94 0 bottom
R65  10k  [0603]  29.21,21.59 180 bottom
R66  0  [0603]  32.31,58.5 90 top
R67  0  [0603]  64.77,62.51 180 top
R68  1.20k  [0603]  48.16,51.23 90 bottom
R69  1.20k  [0603]  50.85,51.23 90 bottom
R70  0  [0603]  59.99,62.38 0 top
R71  0  [0603]  60.12,60.81 0 top
R72  0  [0603]  60.5,62.71 0 bottom
R73  0  [0603]  60.25,60.07 0 bottom
SJ1  [SOLDERJUMPER_ARROW_NOPASTE]  86.62,82.64 270 top
SJ2  [SOLDERJUMPER_ARROW_NOPASTE]  86.67,86.57 270 top
SJ3  -25mA  [SOLDERJUMPER_CLOSEDWIRE]  110.11,30.75 180 top
U1  TFP401  [S-PQFP-G100]  66.65,75.85 270 bottom
U2  24LC02BT-I/OT  [SOT23-5]  81.3,92.65 270 top
U3  XT60  [XT60-FP-MH]  21.51,93.09 270 top
U4  FAN5333BSX  [SOT23-5]  110.62,33.85 270 top
U5  9DoF IMU  [QFN24-3X3]  6.07,33.76 0 top
U7  LM3671  [SOT-23-5]  46.76,69.4 180 top
U8  2.2uH  [3P2MM-X-3P2MM-INDUCTOR]  47.52,64.68 270 top
U30  CONN-HEADER-5-103414-1  [HEADER-5-103414-1]  83.31,7.44 270 bottom
U31  MOUNTINGHOLE3.0  [MOUNTINGHOLE_3.0_PLATED]  4,102.66 0 top
U32  MOUNTINGHOLE3.0  [MOUNTINGHOLE_3.0_PLATED]  116.7,102.66 0 top
U33  MOUNTINGHOLE3.0  [MOUNTINGHOLE_3.0_PLATED]  116.7,18.86 0 top
U34  MOUNTINGHOLE3.0  [MOUNTINGHOLE_3.0_PLATED]  4,18.86 0 top
U35  [OS-SPDT-MINI-SLIDE_SWITCH]  2.24,82.12 270 top
U37  STM32F427VIT6  [LQFP-100]  21.72,39.32 0 top
U38  TSX-3325  [TSX-3225]  20.75,27.89 90 top
U39  CORTEX_JTAG  [CORTEX-JTAG-HDR]  6.22,46.58 0 top
U41  CONN-HEADER-5-103414-1  [HEADER-5-103414-1]  77.67,7.47 270 bottom
U42  COINCELL_6P8MM  [COIN_CELL_HOLDER_6P8MM]  46.38,87.12 180 top
U43  DS1340U  [USOP-8]  44.02,55.37 0 top
U44  CRYSTAL-ECS-ECX34B  [CRYSTAL-ECX34B-3P2MM_1P5MM]  39.7,55.88 270 top
U45  MAX98357  [TQFN-16]  72.82,38.02 270 bottom
U56  TXS0104  [TSSOP14]  75.64,23.24 180 bottom
U61  TB6612FNG  [SSOP24]  54.36,22.58 0 top
U62  APB3025ESGC-F01  [DUAL_SMT_LED]  57.05,2.69 90 bottom
U63  APB3025ESGC-F01  [DUAL_SMT_LED]  53.24,2.69 90 bottom
U64  TB6612FNG  [SSOP24]  39.88,22.58 0 top
U65  APB3025ESGC-F01  [DUAL_SMT_LED]  42.44,2.82 90 bottom
U66  APB3025ESGC-F01  [DUAL_SMT_LED]  38.63,2.82 90 bottom
U67  AT24CS01-STUM-T  [SOT-23-5]  53.54,55.52 0 top
U68  FUSE-RESET-0603L100SLYR  [0603']  81.53,8.33 270 top
U69  FUSE-RESET-0603L100SLYR  [0603']  75.62,8.38 270 top
U70  FUSE-RESET-0603L100SLYR  [0603']  70.18,8.38 270 top
U71  FUSE-RESET-0603L100SLYR  [0603']  64.26,8.38 270 top
U72  AP65502  [SO-8EP]  31.67,64.64 180 top
U73  AP65502  [SO-8EP]  15.14,64.16 180 top
U74  2920L500-16MR  [FUSE-2920]  24.82,80.37 0 top
U75  PUSHBUTTON-1571527-2  [BUTTON-1571527-2]  10.31,5.69 270 bottom
U76  CONN-HEADER-5-103414-1  [HEADER-5-103414-1]  71.83,7.49 270 bottom
U77  CONN-HEADER-5-103414-1  [HEADER-5-103414-1]  66.07,7.49 270 bottom
U$8  [TSSOP16]  67.26,56.01 180 top
X1  47151-0001  [HDMI_MOLEX_47151-0001_DIMLAYER]  69.1,89.71 180 top